# EAGLE design MicorMouse2020Classic-Servos (EAGLE 9.3.0)
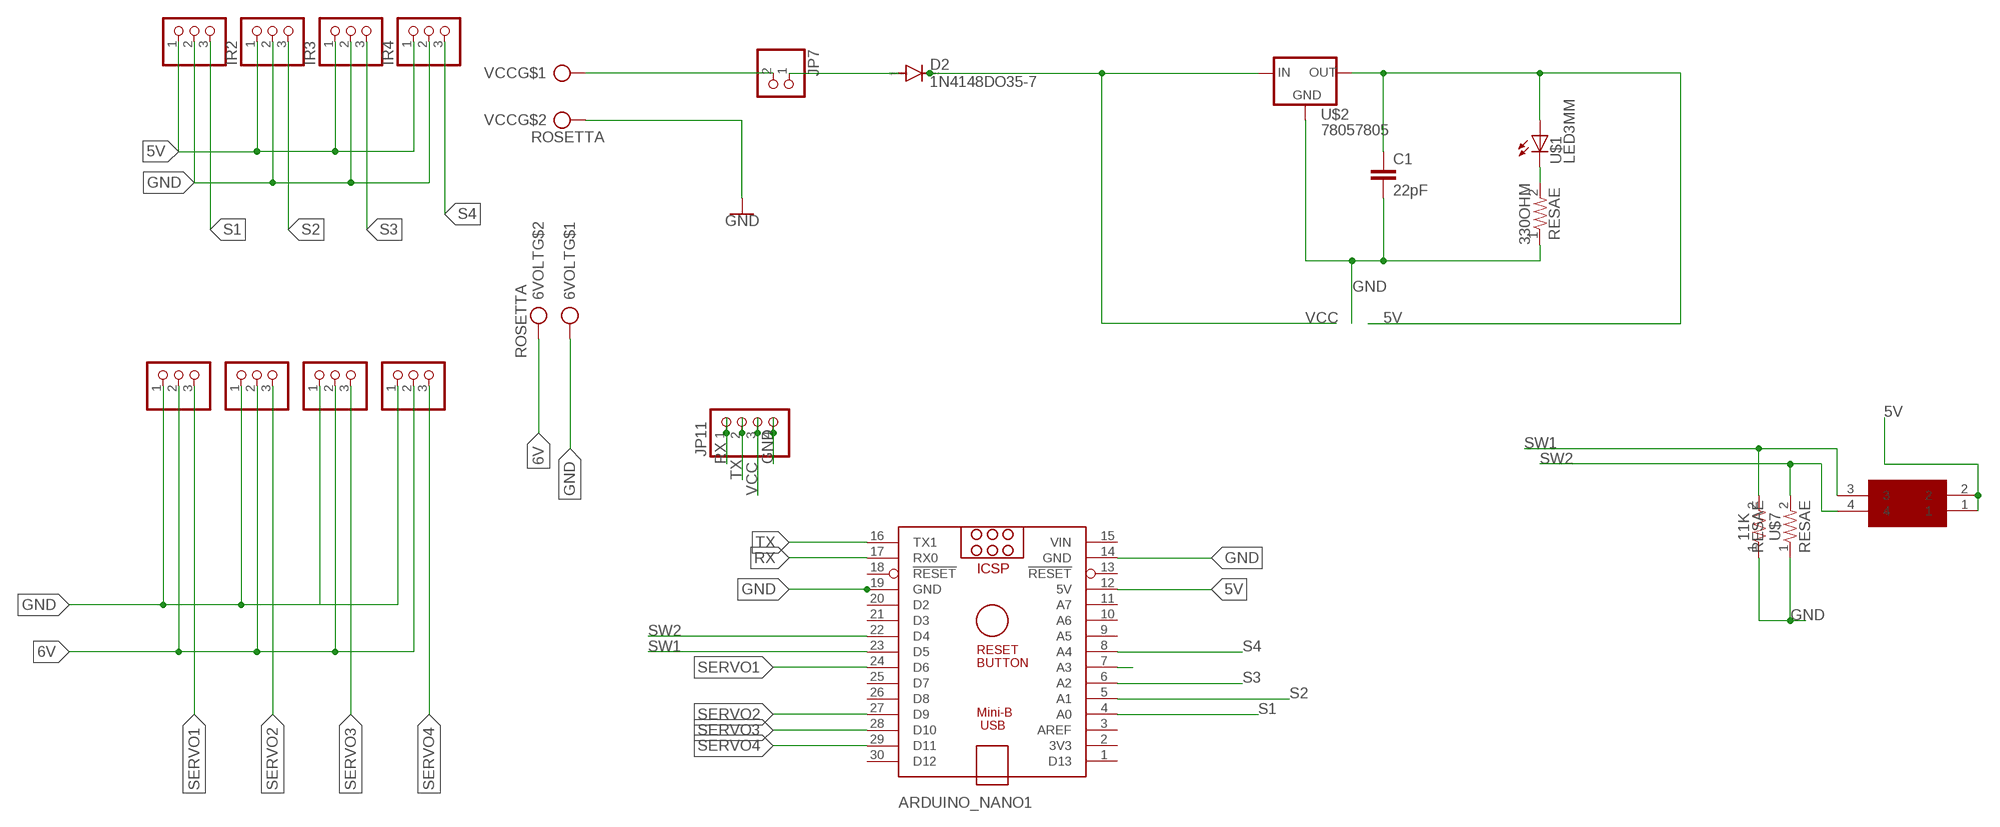
[diagram p0: schematic, sheet 1]

## Parts
6VOLT  ROSETTA  [AK550/2]
11K  RESAE  [RESAD846W63L520D250B]
330OHM  RESAE  [RESAD846W63L520D250B]
ARDUINO_NANO1  ARDUINO_NANO  [ARDUINO_NANO]
C1  22pF  22PF-PTH-2.54MM-200V-5%  [CAP-PTH-2.54]
D2  1N4148DO35-7  [DO35-7]
IR1  PINHD-1X3  [1X03]
IR2  PINHD-1X3  [1X03]
IR3  PINHD-1X3  [1X03]
IR4  PINHD-1X3  [1X03]
JP7  PINHD-1X2  [1X02]
JP11  PINHD-1X4/90  [1X04/90]
SERVO1  PINHD-1X3  [1X03]
SERVO2  PINHD-1X3  [1X03]
SERVO3  PINHD-1X3  [1X03]
SERVO4  PINHD-1X3  [1X03]
U$1  LED3MM  [LEDRD254W60D310H860B]
U$2  78057805  [T-30_V]
U$7  RESAE  [RESAD846W63L520D250B]
U$8  AE-DIP  [EPG-02]
VCC  ROSETTA  [AK550/2]

## Nets
5V: ARDUINO_NANO1.12(5V) C1.1 IR1.1 IR2.1 IR3.1 IR4.1 U$1.A U$2.3(OUT) U$8.1 U$8.2
6V: 6VOLT.2 SERVO1.2 SERVO2.2 SERVO3.2 SERVO4.2
GND: 6VOLT.1 11K.1 330OHM.1 ARDUINO_NANO1.14(GND) ARDUINO_NANO1.19(GND) C1.2 IR1.2 IR2.2 IR3.2 IR4.2 JP11.4 SERVO1.1 SERVO2.1 SERVO3.1 SERVO4.1 U$2.2(GND) U$7.1 VCC.2
N$1: ARDUINO_NANO1.7(A3)
N$2: JP7.2 VCC.1
N$3: D2.A JP7.1
N$5: 330OHM.2 U$1.C
RX: ARDUINO_NANO1.17(RX0) JP11.1
S1: ARDUINO_NANO1.4(A0) IR1.3
S2: ARDUINO_NANO1.5(A1) IR2.3
S3: ARDUINO_NANO1.6(A2) IR3.3
S4: ARDUINO_NANO1.8(A4) IR4.3
SERVO1: ARDUINO_NANO1.24(D6) SERVO4.3
SERVO2: ARDUINO_NANO1.27(D9) SERVO3.3
SERVO3: ARDUINO_NANO1.28(D10) SERVO2.3
SERVO4: ARDUINO_NANO1.29(D11) SERVO1.3
SW1: 11K.2 ARDUINO_NANO1.23(D5) U$8.3
SW2: ARDUINO_NANO1.22(D4) U$7.2 U$8.4
TX: ARDUINO_NANO1.16(TX1) JP11.2
VCC: D2.C JP11.3 U$2.1(IN)
Unconnected: ARDUINO_NANO1.1(D13) ARDUINO_NANO1.2(3V3) ARDUINO_NANO1.3(AREF) ARDUINO_NANO1.9(A5) ARDUINO_NANO1.10(A6) ARDUINO_NANO1.11(A7) ARDUINO_NANO1.13(!RESET) ARDUINO_NANO1.18(!RESET) ARDUINO_NANO1.20(D2) ARDUINO_NANO1.21(D3) ARDUINO_NANO1.25(D7) ARDUINO_NANO1.26(D8) ARDUINO_NANO1.30(D12)

## Power pins joined to a net without a drawn wire
VIN: ARDUINO_NANO1.15(VIN)

## Library data of the parts
6VOLT VCC = con-ptr500:ROSETTA
11K 330OHM U$7 = SparkFun-Resistors:RESAE
ARDUINO_NANO1 = ArduinoNanoV30:ARDUINO_NANO: Arduino Nano V3.0 Overview: The Arduino Nano is a small, complete, and breadboard-friendly board based on the ATmega328 (Arduino Nano 3.x) or ATmega168 (Arduino Nano 2.x). It has more or less the same functionality of the Arduino Duemilanove, but in a different package. It lacks only a DC power jack, and works with a Mini-B USB cable instead of a standard one. The Nano was designed and is being produced by Gravitech. Specifications: Microcontroller Atmel ATmega168 or ATmega328 Operating Voltage (logic level) 5 V Input Voltage (recommended) 7-12 V Input Voltage (limits) 6-20 V Digital I/O Pins 14 (of which 6 provide PWM output) Analog Input Pins 8 DC Current per I/O Pin 40 mA Flash Memory 16 KB (ATmega168) or 32 KB (ATmega328) of which 2 KB used by bootloader SRAM 1 KB (ATmega168) or 2 KB (ATmega328) EEPROM 512 bytes (ATmega168) or 1 KB (ATmega328) Clock Speed 16 MHz Dimensions 0.73" x 1.70" Length 45 mm Width 18 mm Weigth 5 g Power: The Arduino Nano can be powered via the Mini-B USB connection, 6-20V unregulated external power supply (pin 30), or 5V regulated external power supply (pin 27). The power source is automatically selected to the highest voltage source. Memory: The ATmega168 has 16 KB of flash memory for storing code (of which 2 KB is used for the bootloader); the ATmega328 has 32 KB, (also with 2 KB used for the bootloader). The ATmega168 has 1 KB of SRAM and 512 bytes of EEPROM (which can be read and written with the EEPROM library); the ATmega328 has 2 KB of SRAM and 1 KB of EEPROM. Input and Output: Each of the 14 digital pins on the Nano can be used as an input or output, using pinMode(), digitalWrite(), and digitalRead() functions. They operate at 5 volts. Each pin can provide or receive a maximum of 40 mA and has an internal pull-up resistor (disconnected by default) of 20-50 kOhms. In addition, some pins have specialized functions. Visit Arduino - ArduinoBoardNano <https://www.arduino.cc/en/Main/ArduinoBoardNano>
C1 = SparkFun-Capacitors:22PF: 22pF ceramic capacitors A capacitor is a passive two-terminal electrical component used to store electrical energy temporarily in an electric field.; PROD_ID: CAP-09128
D2 = diode:1N4148: DIODE high speed (Philips)
IR1-IR4 SERVO1-SERVO4 = pinhead:PINHD-1X3: PIN HEADER
JP7 = pinhead:PINHD-1X2: PIN HEADER
JP11 = pinhead:PINHD-1X4: PIN HEADER
U$1 = led:LED3MM
U$2 = v-reg:7805
U$8 = EPG-02:AE-DIP

## Board
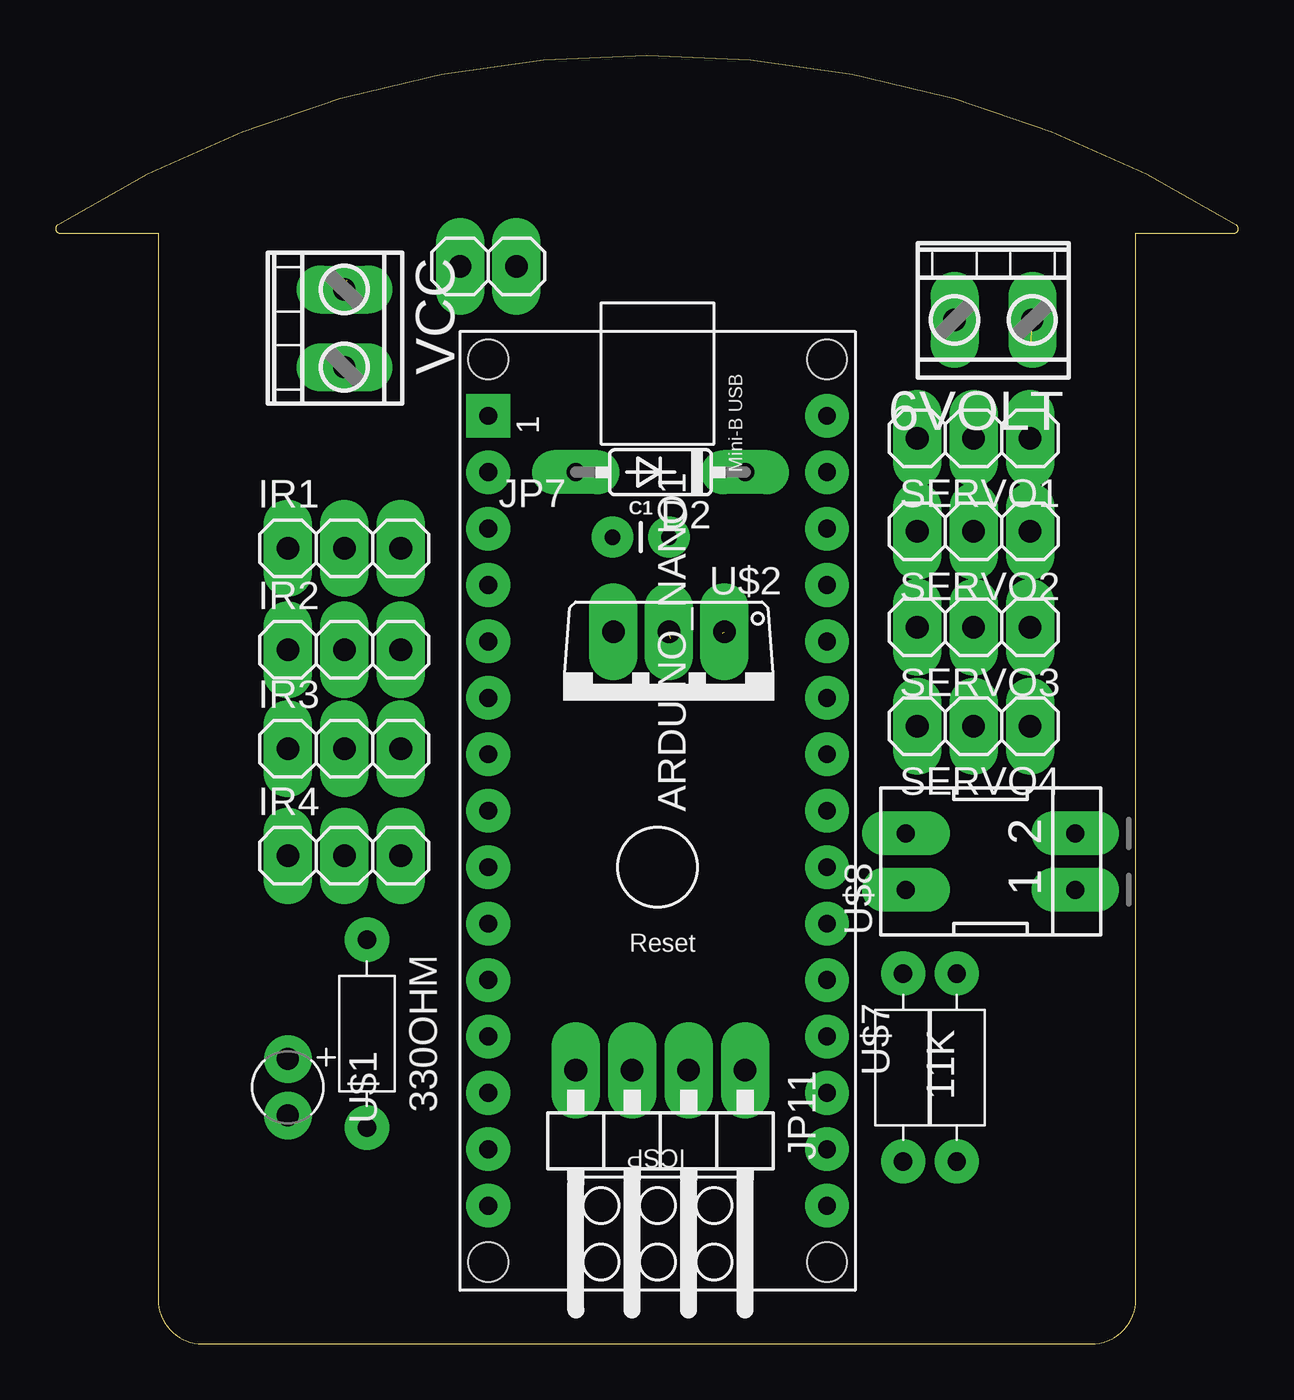
[diagram p1: board, top side]
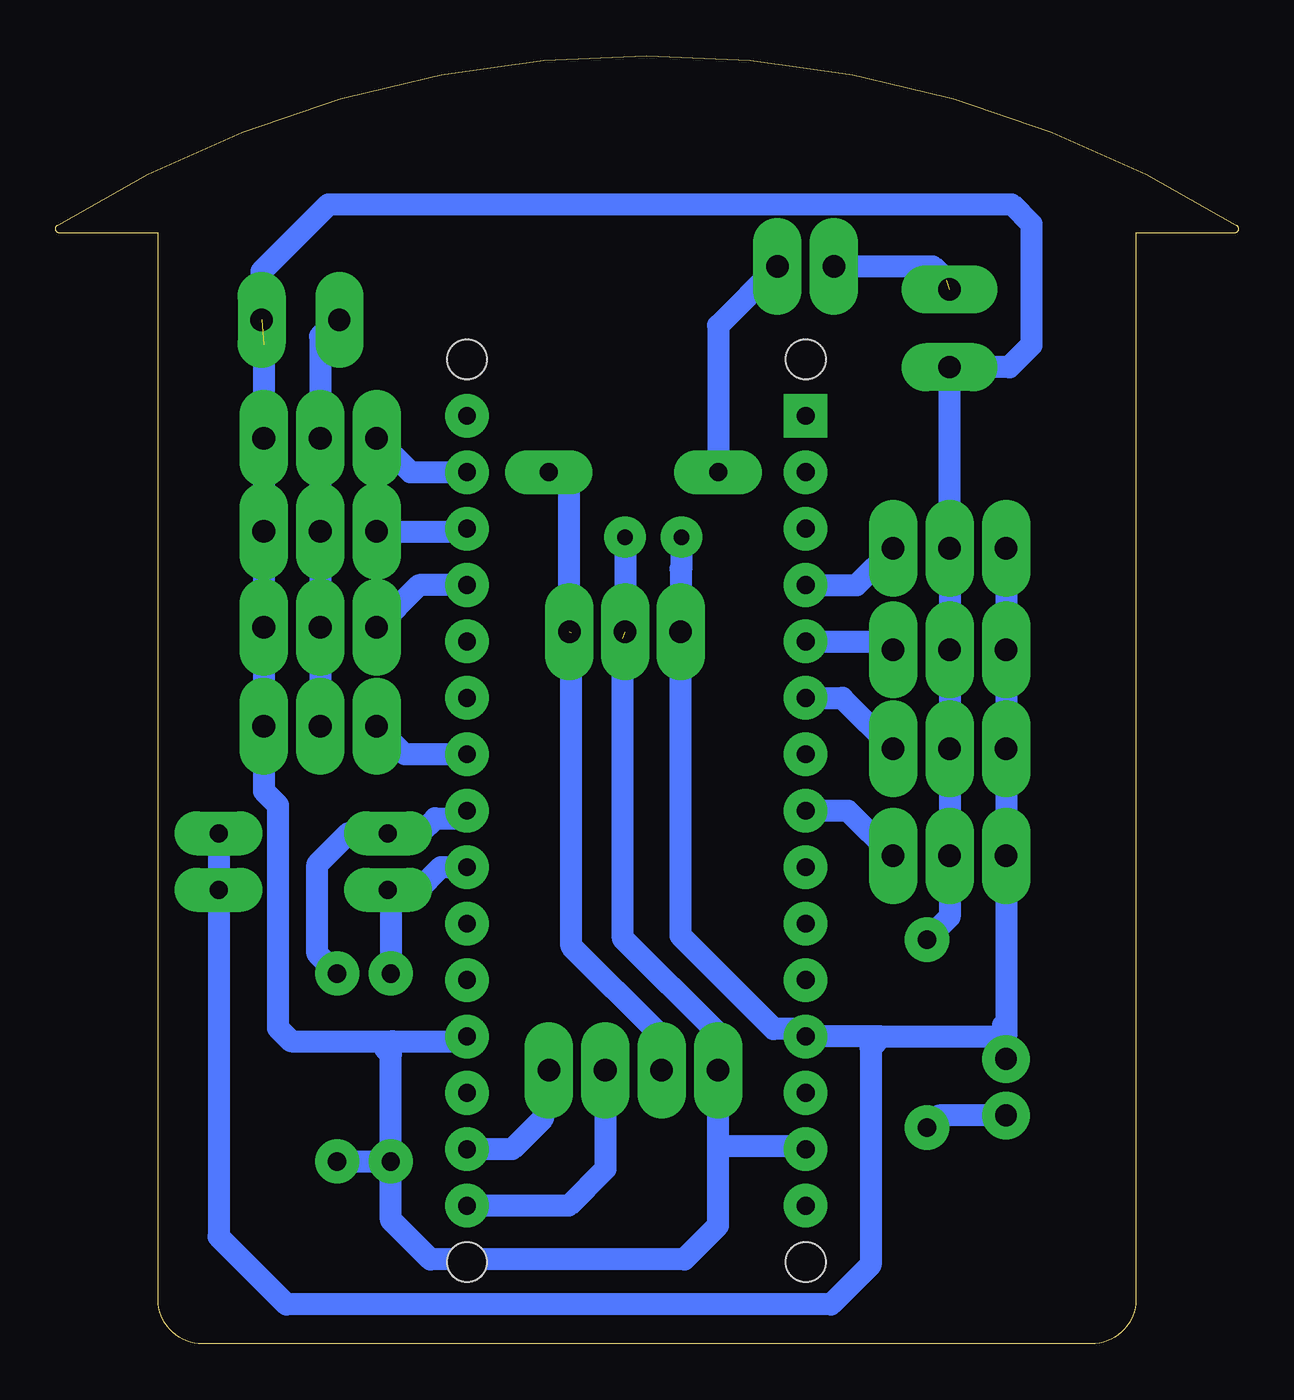
[diagram p2: board, bottom side, seen from below]

Size 53.23 x 58 mm. Coordinates in mm from the lower left corner, seen from the top.
Outline: 53.03,50 arc148 53.13,50.37 arc64 0.09,50.37 arc148 0.2,50 4.61,50 4.61,2 arc90 6.61,0 46.61,0 arc90 48.61,2 48.61,50 53.03,50
Copper layers (1*16): Top 0.035mm / dielectric 1.5mm / Bottom 0.035mm
Design rules "default *": minimum track width 1mm, minimum drill 0.8mm, track to track 0.6mm, track to pad 0.8mm, pad to pad 6mil, via to via 6mil, smd to smd 6mil, copper to edge 40mil, drill to drill 6mil, minimum pad ring 0.58mm, minimum via ring 8mil, stop-mask expansion 4mil, vias tented up to drill 0mil, thermal gap 10mil

### Footprints (pad centres in the part's own frame; a part is rotated, then mirrored left to right if it is on the bottom)
AK550/2 = drill 1 pad 1.5 long: 1 -1.75,0; 2 1.75,0
RESAD846W63L520D250B = drill 0.83 pad 1.43: 1 -4.23,0; 2 4.23,0
ARDUINO_NANO = drill 0.8 square: 1 -20.32,-7.62 | drill 0.8: 2 -17.78,-7.62; 3 -15.24,-7.62; 4 -12.7,-7.62; 5 -10.16,-7.62; 6 -7.62,-7.62; 7 -5.08,-7.62; 8 -2.54,-7.62; 9 0,-7.62; 10 2.54,-7.62; 11 5.08,-7.62; 12 7.62,-7.62; 13 10.16,-7.62; 14 12.7,-7.62; 15 15.24,-7.62; 16 15.24,7.62; 17 12.7,7.62; 18 10.16,7.62; 19 7.62,7.62; 20 5.08,7.62; 21 2.54,7.62; 22 0,7.62; 23 -2.54,7.62; 24 -5.08,7.62; 25 -7.62,7.62; 26 -10.16,7.62; 27 -12.7,7.62; 28 -15.24,7.62; 29 -17.78,7.62; 30 -20.32,7.62 | hole 1.778: -22.86,-7.62; -22.86,7.62; 17.78,7.62; 17.78,-7.62
CAP-PTH-2.54 = drill 0.7 pad 1.651: 1 -1.27,0; 2 1.27,0
DO35-7 = drill 0.813 long: A 3.81,0; C -3.81,0
1X03 = drill 1.016 long: 1 -2.54,0; 2 0,0; 3 2.54,0
1X02 = drill 1.016 long: 1 -1.27,0; 2 1.27,0
1X04/90 = drill 1.016 long: 1 -3.81,-3.81; 2 -1.27,-3.81; 3 1.27,-3.81; 4 3.81,-3.81
LEDRD254W60D310H860B = drill 0.981 pad 1.581: A -1.27,0; C 1.27,0
T-30_V = drill 1.016 long: 1 -2.5,-3.1; 2 0,-3.1; 3 2.5,-3.1
EPG-02 = drill 0.813 long: 1 -1.27,-3.81; 2 1.27,-3.81; 3 1.27,3.81; 4 -1.27,3.81

### Placement (x,y rotation side)
6VOLT  42.2,46.1 180 top
11K  40.55,12.45 90 top
330OHM  14.01,13.97 270 top
ARDUINO_NANO1  27.09,21.46 270 top
C1  26.33,36.32 0 top
D2  27.22,39.24 180 top
IR1  12.99,35.81 0 top
IR2  12.99,31.24 0 top
IR3  12.99,26.8 0 top
IR4  12.99,21.97 0 top
JP7  19.47,48.51 180 top
JP11  27.22,8.51 180 top
SERVO1  41.32,40.77 180 top
SERVO2  41.32,36.58 180 top
SERVO3  41.32,32.26 180 top
SERVO4  41.32,27.81 180 top
U$1  10.45,11.56 270 top
U$2  27.6,28.96 180 top
U$7  38.14,12.45 90 top
U$8  42.08,21.72 90 top
VCC  12.99,45.72 270 top

### Tracks (layer width: path | path; a pad name or v marks a point on that pad's centre or on a via)
5V
  Bottom 1: 16.04,13.84 ARDUINO_NANO1.12 19.81,14.18 20.91,14.18 25.1,18.37 U$2.3 25.1,34.9 25.07,34.93 C1.1 | IR1.1 IR2.1 IR3.1 IR4.1 10.45,13.84 16.04,13.84 | 16.04,13.84 16.55,13.34 16.55,3.56 18.33,1.78 42.84,1.78 45.89,4.83 U$8.1 U$8.2 | U$1.A 10.45,14.22 10.58,14.35
6V
  Bottom 1: SERVO4.2 SERVO3.2 SERVO2.2 SERVO1.2 41.32,45.36 40.58,46.1 6VOLT.2
GND  (2 unrouted)
  Bottom 1: ARDUINO_NANO1.19 34.92,13.63 38.05,13.63 | 38.05,13.63 38.39,13.29 38.14,13.04 U$7.1 | 43.86,44.98 SERVO1.1 SERVO2.1 SERVO3.1 SERVO4.1 43.86,24.89 43.22,24.26 43.22,14.22 42.63,13.63 38.05,13.63 | 23.41,8.89 23.41,5.33 24.93,3.81 36.36,3.81 38.14,5.59 U$7.1 | 23.41,8.89 JP11.4 23.41,13.97 27.69,18.25 27.69,31.75 | ARDUINO_NANO1.14 19.6,8.89 23.41,8.89 | C1.2 U$2.2 | 6VOLT.1 43.95,48.29 40.93,51.31 10.2,51.31 9.31,50.42 9.31,44.96 10.3,43.97 VCC.2 IR1.2 IR2.2 IR3.2 IR4.2 12.99,19.22 330OHM.1 | 11K.1 U$7.1
N$2  (1 unrouted)
  Bottom 1: JP7.2 13.76,48.51 13.12,47.88
N$3
  Bottom 1: JP7.1 23.41,45.85 D2.A
N$5
  Bottom 1: U$1.C 13.46,10.29 330OHM.2
RX
  Bottom 1: JP11.1 31.28,12.06 31.28,10.16 32.68,8.76 ARDUINO_NANO1.17
S1
  Bottom 1: ARDUINO_NANO1.4 17.19,34.16 IR1.3
S2
  Bottom 1: ARDUINO_NANO1.5 15.92,31.62 IR2.3
S3
  Bottom 1: ARDUINO_NANO1.6 17.82,29.08 IR3.3
S4
  Bottom 1: IR4.3 17.57,24 ARDUINO_NANO1.8
SERVO1
  Bottom 1: ARDUINO_NANO1.24 37.51,26.54 SERVO4.3
SERVO2
  Bottom 1: ARDUINO_NANO1.27 36.87,34.16 SERVO3.3
SERVO3
  Bottom 1: SERVO2.3 34.84,36.58 ARDUINO_NANO1.28
SERVO4
  Bottom 1: SERVO1.3 37.25,39.24 ARDUINO_NANO1.29
SW1
  Bottom 1: 11K.2 41.44,17.56 41.44,21.59 40.05,22.99 U$8.3 36.83,22.99 36.15,23.66 35.05,23.66 ARDUINO_NANO1.23
SW2
  Bottom 1: ARDUINO_NANO1.22 35.89,21.46 36.95,20.4 38.22,20.4 U$8.4 38.14,20.45 U$7.2
TX
  Bottom 1: JP11.2 28.49,7.87 30.14,6.22 ARDUINO_NANO1.16
VCC  (1 unrouted)
  Bottom 1: JP11.3 26.08,12.45 26.08,13.97 30.01,17.91 30.01,32 | D2.C 30.39,39.24 30.1,38.95 U$2.1